# EAGLE design flux1.1 (EAGLE 6.4)
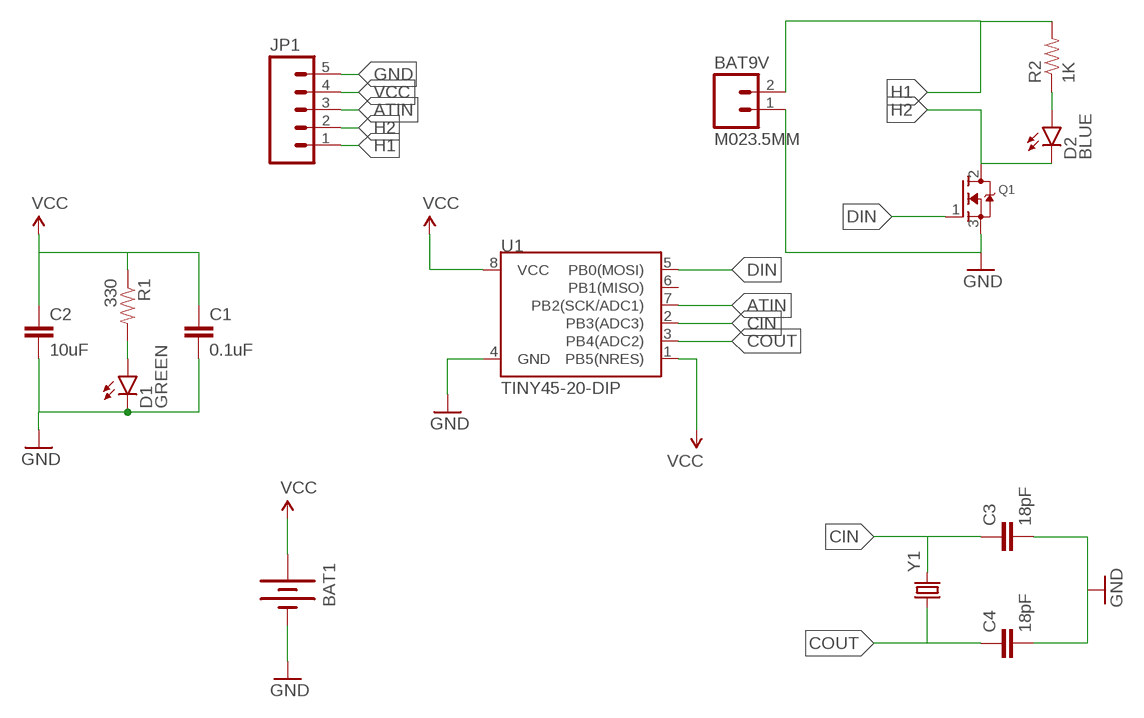
[diagram p0: schematic, sheet 1]

## Parts
BAT1  BATTERY12MM  [BATTCON_12MM]
BAT9V  M023.5MM  [SCREWTERMINAL-3.5MM-2]
C1  0.1uF  0.1UF-25V(+80/-20%)(0603)  [0603-CAP]
C2  10uF  10UF-6.3V-20%(0603)  [0603-CAP]
C3  18pF  18PF-50V-5%(0603)  [0603-CAP]
C4  18pF  18PF-50V-5%(0603)  [0603-CAP]
D1  GREEN  LED-GREEN0603  [LED-0603]
D2  BLUE  LED-BLUE0603  [LED-0603]
JP1  M05SMD  [1X05-1MM]
Q1  MOSFET-NGDS_TO220V  [TO220V]
R1  330  330OHM1/10W1%(0603)  [0603-RES]
R2  1K  1KOHM1/10W1%(0603)  [0603-RES]
U1  TINY45-20-DIP  ATTINY45TINY45-20-DIP  [DIP08]
Y1  CRYSTALHC49US  [HC49US]

## Nets
ATIN: JP1.3 U1.7(PB2(SCK/ADC1))
CIN: C3.1 U1.2(PB3(ADC3)) Y1.2
COUT: C4.1 U1.3(PB4(ADC2)) Y1.1
DIN: Q1.1(G) U1.5(PB0(MOSI))
GND: BAT1.GND(-) BAT9V.1 C1.2 C2.2 C3.2 C4.2 D1.C JP1.5 Q1.3(S) U1.4(GND)
H1: BAT9V.2 JP1.1 R2.2
H2: D2.C JP1.2 Q1.2(D)
N$1: D1.A R1.2
N$2: D2.A R2.1
VCC: BAT1.PWR@1(+) C1.1 C2.1 JP1.4 R1.1 U1.1(PB5(NRES)) U1.8(VCC)
Unconnected: U1.6(PB1(MISO))

## Library data of the parts
BAT1 = SparkFun-Electromechanical:BATTERY: Battery Holders Various common sizes : AA, AAA, 20mm coin cell and 12mm coin cell. 20MM_4LEGS, BATT-10373; PROD_ID: BATT-08044
BAT9V = SparkFun-Connectors:M02: Standard 2-pin 0.1" header. Use with - straight break away headers ( PRT-00116) - right angle break away headers (PRT-00553) - swiss pins (PRT-00743) - machine pins (PRT-00117) - female headers (PRT-00115) Molex polarized connector foot print use with: PRT-08233 with associated crimp pins and housings. 2.54_SCREWTERM for use with PRT-10571. 3.5mm Screw Terminal footprints for PRT-08084 5mm Screw Terminal footprints for use with PRT-08432
C1 = SparkFun-Capacitors:0.1UF-25V(+80/-20%)(0603): CAP-00810 Ceramic Standard decoupling cap; PROD_ID: CAP-00810
C2 = SparkFun-Capacitors:10UF-6.3V-20%(0603): CAP-11015; PROD_ID: CAP-11015
C3 C4 = SparkFun-Capacitors:18PF-50V-5%(0603): CAP-08267; PROD_ID: CAP-08267
D1 = SparkFun-LED:LED-GREEN: Various green LEDs Green LEDs used in SFE Production 0603- DIO-00821 LARGE- DIO-00862 LILYPAD- DIO-09910; PROD_ID: DIO-00821
D2 = SparkFun-LED:LED-BLUE: Blue LEDs for production use Various blue LEDs stocked by SparkFun production 0603 - DIO-08575 Rebel - DIO-09553 1206 - DIO-09911; PROD_ID: DIO-08575
JP1 = SparkFun-Connectors:M05: Header 5 Standard 5-pin 0.1" header. Use with straight break away headers (SKU : PRT-00116), right angle break away headers (PRT-00553), swiss pins (PRT-00743), machine pins (PRT-00117), and female headers (PRT-00115). Molex polarized connector foot print use with SKU : PRT-08230 with associated crimp pins and housings.
Q1 = adafruit:MOSFET-N: N-Channel Mosfet 2N7002E - 60V 260mA SOT23 [Digikey: 2N7002ET1GOSTR-ND] - REEL BSH103 - 30V 850mA SOT23 [Digikey: 568-5013-1-ND]
R1 = SparkFun-Resistors:330OHM1/10W1%(0603): RES-00818; PROD_ID: RES-00818
R2 = SparkFun-Resistors:1KOHM1/10W1%(0603): RES-07856; PROD_ID: RES-07856
U1 = SparkFun-DigitalIC:ATTINY45: Atmel 8-pin 2/4/8kB flash uC; PROD_ID: IC-09439
Y1 = SparkFun-FreqCtrl:CRYSTAL: Various standard crystals. Proven footprints. Spark Fun Electronics SKU : COM-00534

## Net classes
0 default: width 0.305 mm, drill 0.559 mm, clearance 0.254 mm

## Board
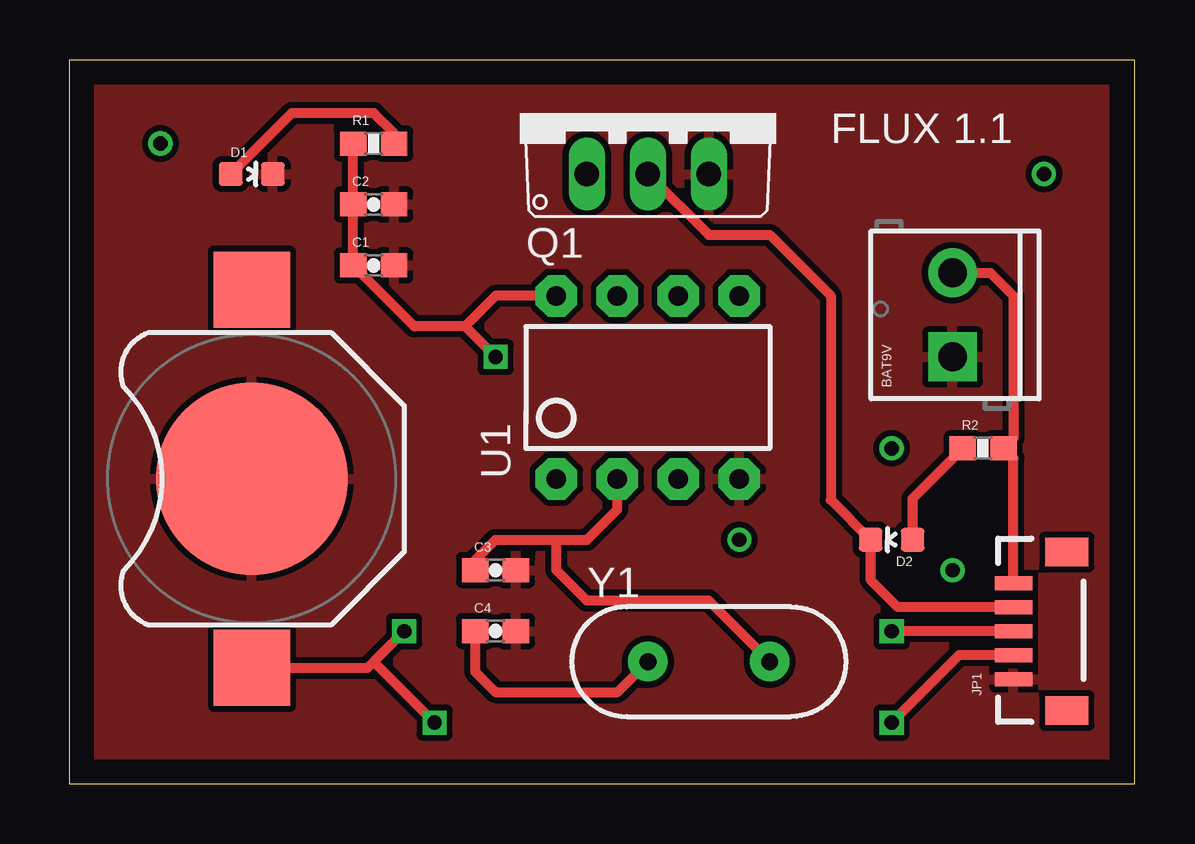
[diagram p1: board, top side]
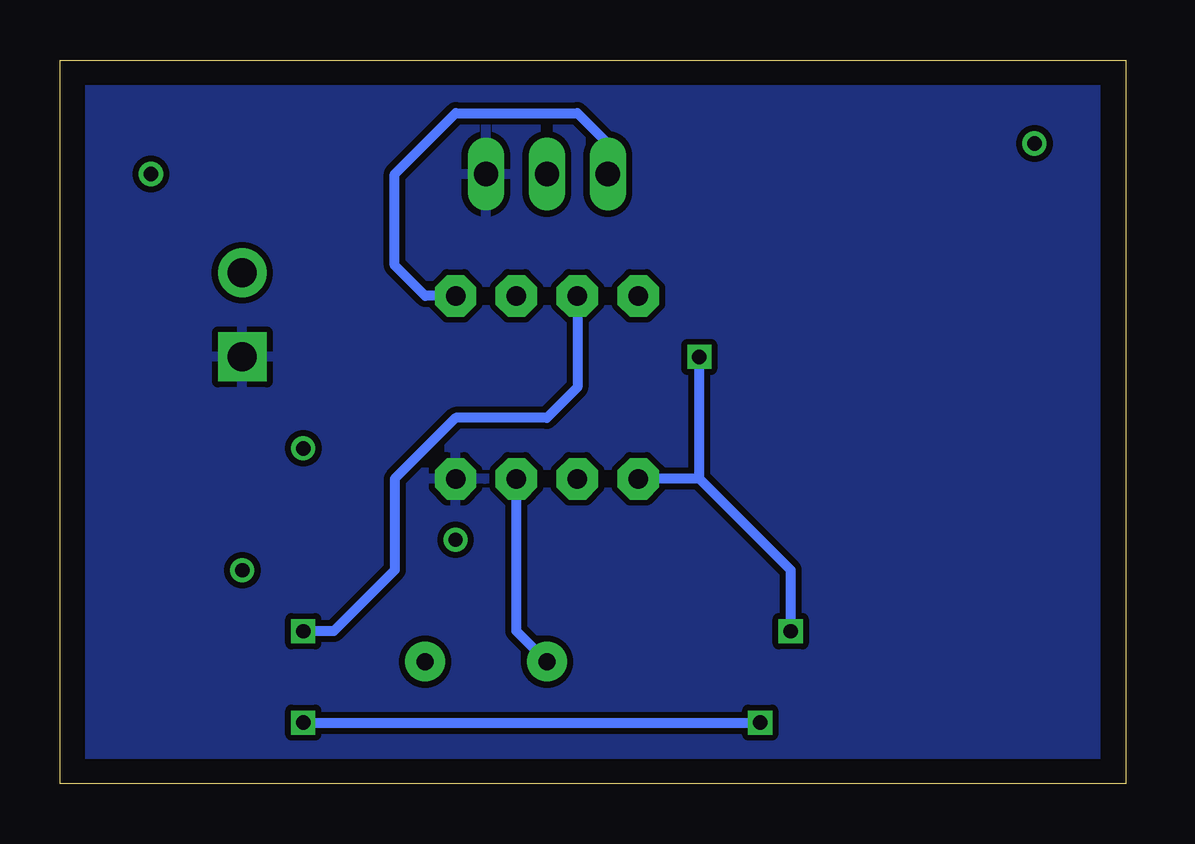
[diagram p2: board, bottom side, seen from below]

Size 44.43 x 30.15 mm. Coordinates in mm from the lower left corner, seen from the top.
Outline: 0,0 44.43,0 44.43,30.15 0,30.15 0,0
Copper layers (1*16): Top 0.035mm / dielectric 1.5mm / Bottom 0.035mm
Design rules "default *": minimum track width 10mil, minimum drill 20mil, track to track 8mil, track to pad 8mil, pad to pad 8mil, via to via 8mil, smd to smd 8mil, copper to edge 40mil, drill to drill 8mil, minimum pad ring 10mil, minimum via ring 8mil, stop-mask expansion 4mil, vias tented up to drill 0mil, thermal gap 10mil

### Footprints (pad centres in the part's own frame; a part is rotated, then mirrored left to right if it is on the bottom)
BATTCON_12MM = smd 8 x 8: GND 0,0 | smd 3.175 x 3.175: PWR@1 -7.874,0; PWR@2 7.874,0
SCREWTERMINAL-3.5MM-2 = drill 1.2 pad 2.032 square: 1 0,0 | drill 1.2 pad 2.032: 2 3.5,0
0603-CAP = smd 1.1 x 1: 1 -0.85,0; 2 0.85,0
LED-0603 = smd 1 x 1: A 0,-0.877; C 0,0.877
1X05-1MM = smd 0.6 x 1.55: 1 -2,0; 2 -1,0; 3 0,0; 4 1,0; 5 2,0 | smd 1.2 x 1.8: NC1 -3.3,2.225; NC2 3.3,2.225
TO220V = drill 1.016 long: 1 -2.54,-2.54; 2 0,-2.54; 3 2.54,-2.54
0603-RES = smd 1.1 x 1: 1 -0.85,0; 2 0.85,0
DIP08 = drill 0.813 pad 1.727 octagon: 1 -3.81,-3.81; 2 -1.27,-3.81; 3 1.27,-3.81; 4 3.81,-3.81; 5 3.81,3.81; 6 1.27,3.81; 7 -1.27,3.81; 8 -3.81,3.81
HC49US = drill 0.7 pad 1.651: 1 -2.54,0; 2 2.54,0

### Placement (x,y rotation side)
BAT1  7.62,12.7 90 top
BAT9V  36.83,17.78 90 top
C1  12.7,21.59 0 top
C2  12.7,24.13 0 top
C3  17.78,8.89 0 top
C4  17.78,6.35 0 top
D1  7.62,25.4 270 top
D2  34.29,10.16 90 top
JP1  39.37,6.35 270 top
Q1  24.13,27.94 0 top
R1  12.7,26.67 0 top
R2  38.1,13.97 0 top
U1  24.13,16.51 0 top
Y1  26.67,5.08 0 top

### Tracks (layer width: path | path; a pad name or v marks a point on that pad's centre or on a via)
ATIN  (via drill 0.6)
  Top 0.406: JP1.3 v34.29,6.35
  Bottom 0.406: U1.7 22.86,16.51 24.13,15.24 27.94,15.24 30.48,12.7 30.48,8.89 33.02,6.35 v34.29,6.35
CIN
  Top 0.406: C3.1 16.93,9.31 17.78,10.16 20.32,10.16 | 20.32,10.16 21.59,10.16 22.86,11.43 U1.2 | Y1.2 26.67,7.62 21.59,7.62 20.32,8.89 20.32,10.16
COUT
  Top 0.406: C4.1 16.93,4.66 17.78,3.81 22.86,3.81 Y1.1
  Bottom 0.406: Y1.1 25.4,6.35 U1.3
DIN
  Bottom 0.406: U1.5 29.21,20.32 30.48,21.59 30.48,25.4 27.94,27.94 22.86,27.94 21.59,26.67 Q1.1
GND
  pour Top: 43.18,29.21 0,29.21 0,0 43.18,0
  pour Bottom: 1.27,29.21 1.27,0 43.18,0 43.18,29.21
H1
  Top 0.406: BAT9V.2 38.41,21.28 39.37,20.32 39.37,14.39 R2.2 39.37,13.55 JP1.1
H2
  Top 0.406: Q1.2 26.67,22.86 29.21,22.86 31.75,20.32 31.75,11.82 D2.C 33.41,8.5 34.56,7.35 JP1.2
N$1
  Top 0.406: R1.2 13.55,27.09 12.7,27.94 9.28,27.94 D1.A
N$2
  Top 0.406: D2.A 35.17,11.89 R2.1
N$3  (via drill 0.6)
  other vias: 3.81,26.67
N$5  (via drill 0.6)
  other vias: 27.94,10.16
N$6  (via drill 0.6)
  other vias: 34.29,13.97
N$7  (via drill 0.6)
  other vias: 36.83,8.89
N$8  (via drill 0.6)
  other vias: 40.64,25.4
VCC  (via drill 0.6)
  Top 0.406: BAT1.PWR@1 12.45,4.83 12.7,5.08 | 12.7,5.08 v13.97,6.35 | U1.8 17.78,20.32 16.51,19.05 | 16.51,19.05 14.39,19.05 C1.1 C2.1 R1.1 | JP1.4 37.1,5.35 v34.29,2.54 | v15.24,2.54 12.7,5.08 | v17.78,17.78 16.51,19.05
  Bottom 0.406: v13.97,6.35 13.97,8.89 17.78,12.7 | 17.78,12.7 U1.1 | v34.29,2.54 v15.24,2.54 | 17.78,12.7 v17.78,17.78

### Text on the board
tPlace: FLUX 1.1